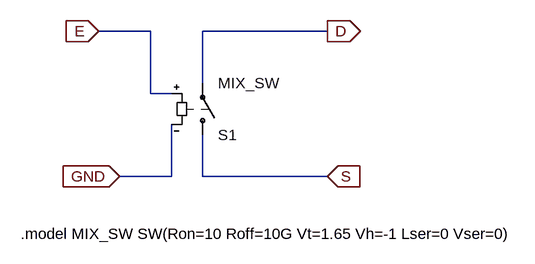
[diagram p0: schematic Analog_Switch.asc]
Analog_Switch.asc, the LTspice schematic file:
Version 4
SHEET 1 2104 5400
WIRE -4128 192 -4208 192
WIRE -3856 192 -4048 192
WIRE -4048 272 -4048 192
WIRE -4128 288 -4128 192
WIRE -4096 288 -4128 288
WIRE -4096 416 -4096 336
WIRE -4096 416 -4176 416
WIRE -4048 416 -4048 352
WIRE -3856 416 -4048 416
FLAG -3856 416 S
IOPIN -3856 416 In
FLAG -3856 192 D
IOPIN -3856 192 Out
FLAG -4208 192 E
IOPIN -4208 192 In
FLAG -4176 416 GND
IOPIN -4176 416 In
SYMBOL sw -4048 368 M180
SYMATTR InstName S1
SYMATTR Value MIX_SW
TEXT -4328 504 Left 2 !.model MIX_SW SW(Ron=10 Roff=10G Vt=1.65 Vh=-1 Lser=0 Vser=0)

The netlist it stands for:
* Analog_Switch.asc
S1 S D E GND MIX_SW
.model MIX_SW SW(Ron=10 Roff=10G Vt=1.65 Vh=-1 Lser=0 Vser=0)
.backanno
.end